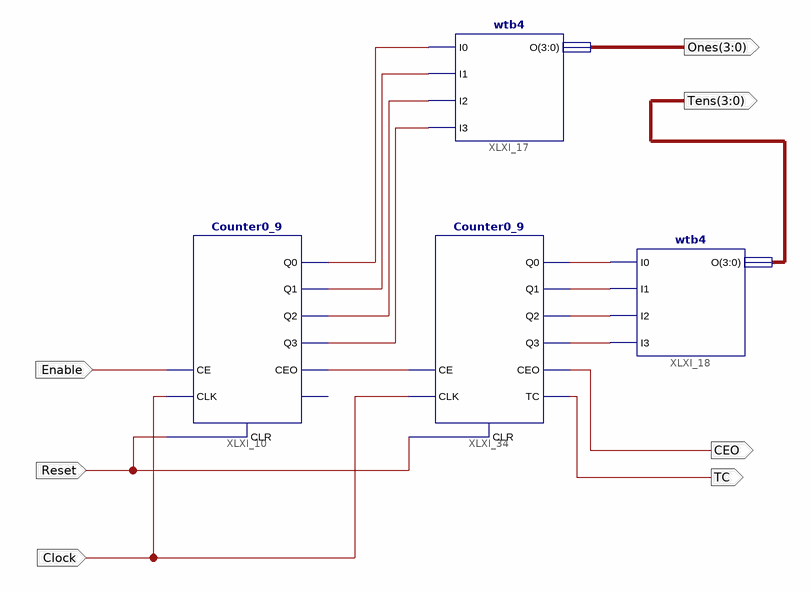
[diagram p0: schematic sheet 1]
// Xilinx ISE schematic Counter00_99.sch (spartan6) as structural Verilog: 4 symbols, 7 ports
module Counter00_99 (
  input  Reset,
  input  Clock,
  input  Enable,
  output [3:0] Ones,
  output [3:0] Tens,
  output CEO,
  output TC
);

  wire XLXN_26, XLXN_67, XLXN_68, XLXN_69, XLXN_70, XLXN_95, XLXN_96, XLXN_97, XLXN_140;

  Counter0_9 XLXI_10 (
    .CE(Enable), .CLK(Clock), .CLR(Reset), .CEO(XLXN_26), .Q0(XLXN_67), .Q1(XLXN_68), .Q2(XLXN_69),
    .Q3(XLXN_70));  // open: TC
  wtb4 XLXI_17 (.I0(XLXN_67), .I1(XLXN_68), .I2(XLXN_69), .I3(XLXN_70), .O(Ones));
  Counter0_9 XLXI_34 (
    .CE(XLXN_26), .CLK(Clock), .CLR(Reset), .CEO(CEO), .Q0(XLXN_140), .Q1(XLXN_95), .Q2(XLXN_96),
    .Q3(XLXN_97), .TC(TC));
  wtb4 XLXI_18 (.I0(XLXN_140), .I1(XLXN_95), .I2(XLXN_96), .I3(XLXN_97), .O(Tens));
endmodule
